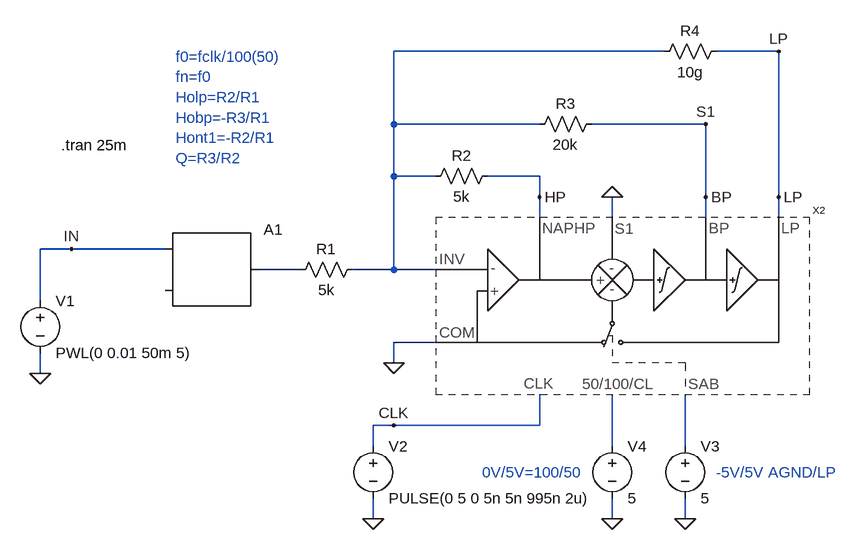
[diagram p0: schematic LTC1060_Mode1.asc]
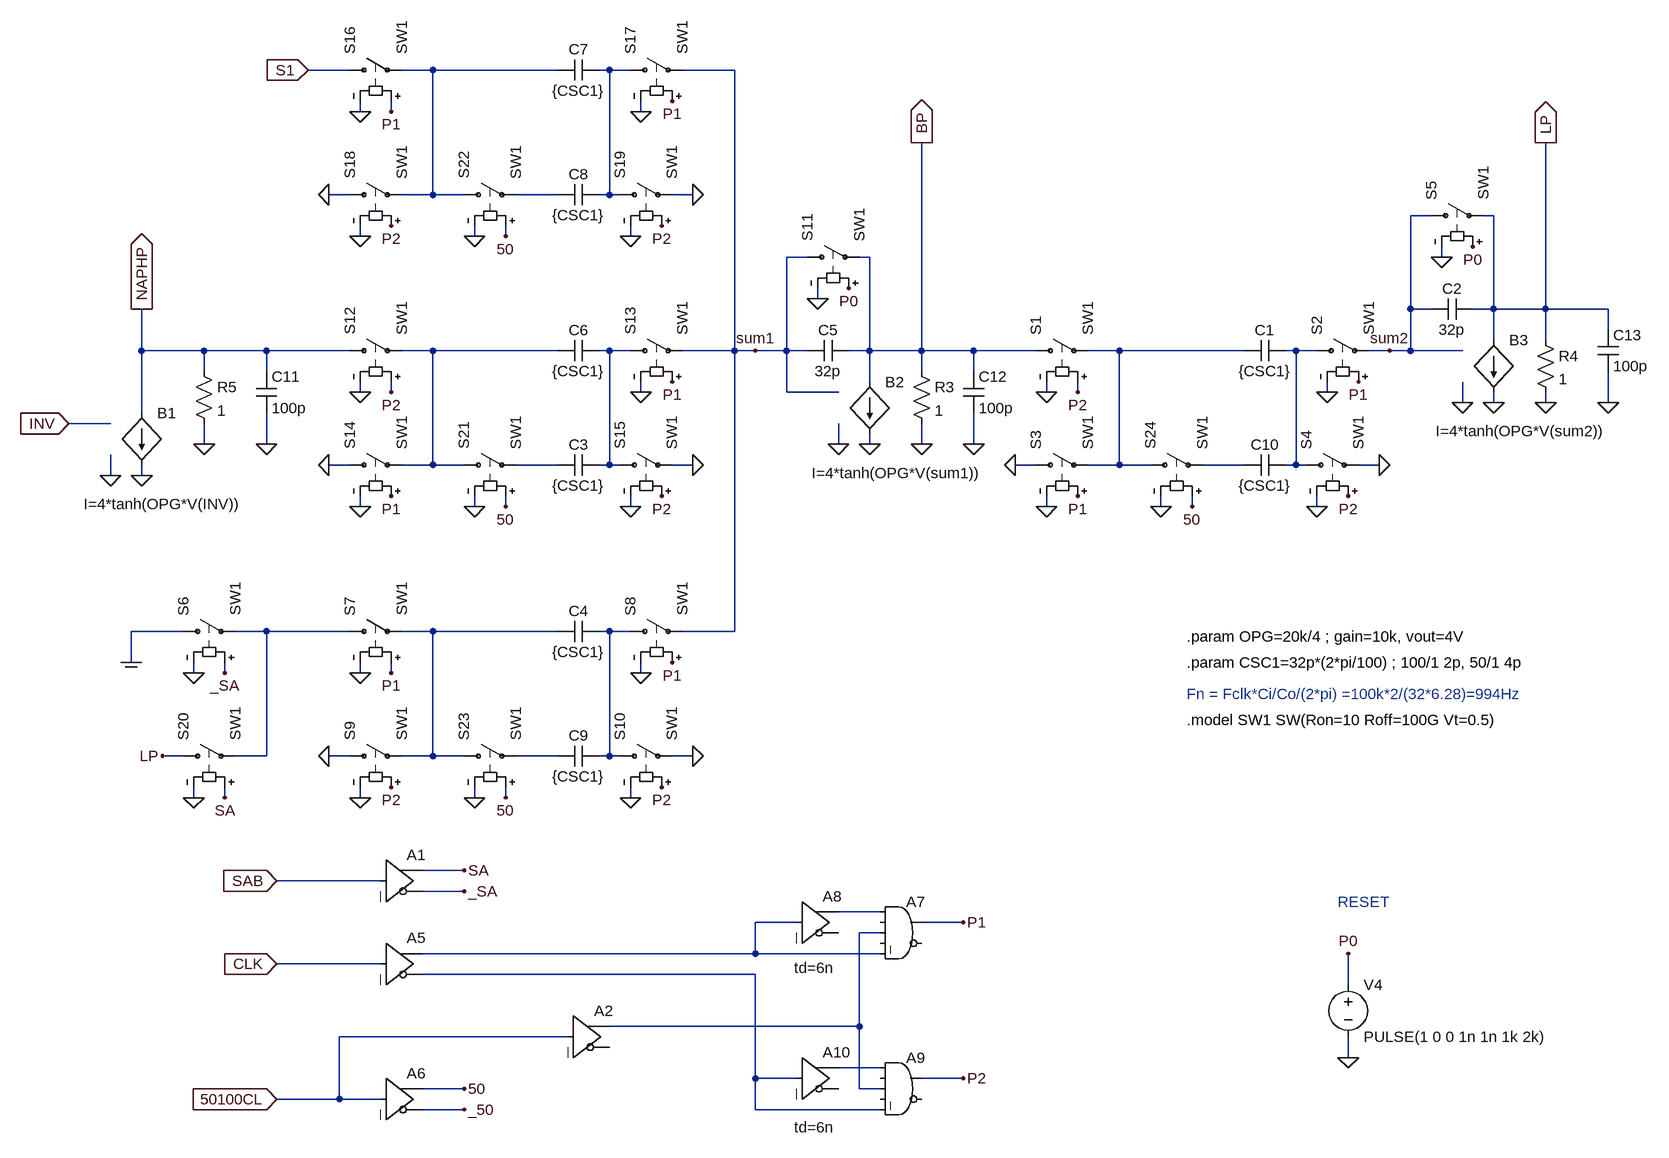
[diagram p1: sub-circuit ltc1060.asc]
LTC1060_Mode1.asc, the LTspice schematic file:
Version 4
SHEET 1 880 680
WIRE 320 -208 -96 -208
WIRE 496 -208 400 -208
WIRE -96 -96 -96 -208
WIRE 128 -96 -96 -96
WIRE 384 -96 208 -96
WIRE -96 -16 -96 -96
WIRE -32 -16 -96 -16
WIRE 128 -16 48 -16
WIRE 128 16 128 -16
WIRE 384 16 384 -96
WIRE 496 16 496 -208
WIRE 128 48 128 16
WIRE 240 48 240 16
WIRE 384 48 384 16
WIRE 496 48 496 16
WIRE -592 96 -640 96
WIRE -448 96 -592 96
WIRE -240 128 -304 128
WIRE -96 128 -96 -16
WIRE -96 128 -160 128
WIRE -32 128 -96 128
WIRE -640 176 -640 96
WIRE -32 240 -96 240
WIRE -96 272 -96 240
WIRE -640 288 -640 256
WIRE -96 368 -128 368
WIRE 128 368 128 320
WIRE 128 368 -96 368
WIRE -128 400 -128 368
WIRE 240 400 240 320
WIRE 352 400 352 320
WIRE -128 512 -128 480
WIRE 240 512 240 480
WIRE 352 512 352 480
FLAG -96 272 0
FLAG 352 512 0
FLAG 496 -208 LP
FLAG 384 -96 S1
FLAG 384 16 BP
FLAG -592 96 IN
FLAG -640 288 0
FLAG -96 368 CLK
FLAG -128 512 0
FLAG 240 512 0
FLAG 240 16 0
FLAG 496 16 LP
FLAG 128 16 HP
SYMBOL res 112 -80 R270
WINDOW 0 32 56 VTop 0
WINDOW 3 0 56 VBottom 0
SYMATTR InstName R3
SYMATTR Value 20k
SYMBOL res -48 0 R270
WINDOW 0 32 56 VTop 0
WINDOW 3 0 56 VBottom 0
SYMATTR InstName R2
SYMATTR Value 5k
SYMBOL res 304 -192 R270
WINDOW 0 32 56 VTop 0
WINDOW 3 0 56 VBottom 0
SYMATTR InstName R4
SYMATTR Value 10g
SYMBOL res -256 144 R270
WINDOW 0 32 56 VTop 0
WINDOW 3 0 56 VBottom 0
SYMATTR InstName R1
SYMATTR Value 5k
SYMBOL voltage -640 160 R0
WINDOW 123 0 0 Left 0
WINDOW 39 0 0 Left 0
SYMATTR InstName V1
SYMATTR Value PWL(0 0.01 50m 5)
SYMBOL voltage -128 384 R0
WINDOW 123 0 0 Left 0
WINDOW 39 0 0 Left 0
SYMATTR InstName V2
SYMATTR Value PULSE(0 5 0 5n 5n 995n 2u)
SYMBOL voltage 352 384 R0
WINDOW 123 0 0 Left 0
WINDOW 39 0 0 Left 0
SYMATTR InstName V3
SYMATTR Value 5
SYMBOL voltage 240 384 R0
WINDOW 123 0 0 Left 0
WINDOW 39 0 0 Left 0
SYMATTR InstName V4
SYMATTR Value 5
SYMBOL SpecialFunctions\\modulate -448 96 R0
SYMATTR InstName A1
SYMATTR Value2 space 0k mark 10k
SYMBOL LTC1060 128 192 R0
SYMATTR InstName X2
TEXT -608 -64 Left 0 !.tran 25m
TEXT 400 440 Left 0 ;-5V/5V AGND/LP
TEXT 40 440 Left 0 ;0V/5V=100/50
TEXT -432 -200 Left 0 ;f0=fclk/100(50)\nfn=f0\nHolp=R2/R1\nHobp=-R3/R1\nHont1=-R2/R1\nQ=R3/R2

ltc1060.asc, the sub-circuit schematic file:
Version 4
SHEET 1 1276 1464
WIRE -864 -256 -928 -256
WIRE -736 -256 -784 -256
WIRE -544 -256 -736 -256
WIRE -464 -256 -480 -256
WIRE -432 -256 -464 -256
WIRE -272 -256 -352 -256
WIRE -848 -192 -848 -208
WIRE -800 -192 -800 -208
WIRE -416 -192 -416 -208
WIRE -864 -64 -896 -64
WIRE -736 -64 -736 -256
WIRE -736 -64 -784 -64
WIRE -688 -64 -736 -64
WIRE -544 -64 -608 -64
WIRE -464 -64 -464 -256
WIRE -464 -64 -480 -64
WIRE -448 -64 -464 -64
WIRE -336 -64 -368 -64
WIRE 800 -32 768 -32
WIRE 896 -32 880 -32
WIRE -848 0 -848 -16
WIRE -672 0 -672 -16
WIRE -624 0 -624 -16
WIRE -432 0 -432 -16
WIRE -160 32 -192 32
WIRE -64 32 -80 32
WIRE 816 32 816 16
WIRE -144 96 -144 80
WIRE 768 112 768 -32
WIRE 800 112 768 112
WIRE 896 112 896 -32
WIRE 896 112 864 112
WIRE 976 112 976 -144
WIRE 976 112 896 112
WIRE 1072 112 976 112
WIRE 1072 144 1072 112
WIRE 896 160 896 112
WIRE 976 160 976 112
WIRE -1184 176 -1184 112
WIRE -1088 176 -1184 176
WIRE -992 176 -1088 176
WIRE -864 176 -992 176
WIRE -736 176 -784 176
WIRE -544 176 -736 176
WIRE -464 176 -480 176
WIRE -432 176 -464 176
WIRE -272 176 -272 -256
WIRE -272 176 -352 176
WIRE -240 176 -272 176
WIRE -192 176 -192 32
WIRE -192 176 -240 176
WIRE -160 176 -192 176
WIRE -64 176 -64 32
WIRE -64 176 -96 176
WIRE 16 176 16 -144
WIRE 16 176 -64 176
WIRE 96 176 16 176
WIRE 192 176 96 176
WIRE 320 176 272 176
WIRE 512 176 320 176
WIRE 592 176 576 176
WIRE 624 176 592 176
WIRE 736 176 704 176
WIRE 768 176 768 112
WIRE 768 176 736 176
WIRE 848 176 768 176
WIRE -1088 208 -1088 176
WIRE -992 208 -992 176
WIRE 16 208 16 176
WIRE 96 208 96 176
WIRE -64 224 -64 176
WIRE -848 240 -848 224
WIRE -800 240 -800 224
WIRE -416 240 -416 224
WIRE -192 240 -192 176
WIRE -112 240 -192 240
WIRE 208 240 208 224
WIRE 256 240 256 224
WIRE 640 240 640 224
WIRE 848 256 848 224
WIRE 896 256 896 240
WIRE 976 256 976 240
WIRE 1072 256 1072 208
WIRE -1184 272 -1184 176
WIRE -1232 288 -1296 288
WIRE -1088 320 -1088 288
WIRE -992 320 -992 272
WIRE -112 320 -112 288
WIRE -64 320 -64 304
WIRE 16 320 16 288
WIRE 96 320 96 272
WIRE -864 352 -896 352
WIRE -736 352 -736 176
WIRE -736 352 -784 352
WIRE -688 352 -736 352
WIRE -544 352 -608 352
WIRE -464 352 -464 176
WIRE -464 352 -480 352
WIRE -448 352 -464 352
WIRE -336 352 -368 352
WIRE 192 352 160 352
WIRE 320 352 320 176
WIRE 320 352 272 352
WIRE 368 352 320 352
WIRE 512 352 448 352
WIRE 592 352 592 176
WIRE 592 352 576 352
WIRE 608 352 592 352
WIRE 720 352 688 352
WIRE -1232 368 -1232 336
WIRE -1184 368 -1184 352
WIRE -848 416 -848 400
WIRE -672 416 -672 400
WIRE -624 416 -624 400
WIRE -432 416 -432 400
WIRE 208 416 208 400
WIRE 384 416 384 400
WIRE 432 416 432 400
WIRE 624 416 624 400
WIRE -1120 608 -1200 608
WIRE -992 608 -1040 608
WIRE -864 608 -992 608
WIRE -736 608 -784 608
WIRE -544 608 -736 608
WIRE -464 608 -480 608
WIRE -432 608 -464 608
WIRE -272 608 -272 176
WIRE -272 608 -352 608
WIRE -1200 656 -1200 608
WIRE -1104 672 -1104 656
WIRE -1056 672 -1056 656
WIRE -848 672 -848 656
WIRE -800 672 -800 656
WIRE -416 672 -416 656
WIRE -1120 800 -1152 800
WIRE -992 800 -992 608
WIRE -992 800 -1040 800
WIRE -864 800 -896 800
WIRE -736 800 -736 608
WIRE -736 800 -784 800
WIRE -688 800 -736 800
WIRE -544 800 -608 800
WIRE -464 800 -464 608
WIRE -464 800 -480 800
WIRE -448 800 -464 800
WIRE -336 800 -368 800
WIRE -1104 864 -1104 848
WIRE -1056 864 -1056 848
WIRE -848 864 -848 848
WIRE -672 864 -672 848
WIRE -624 864 -624 848
WIRE -432 864 -432 848
WIRE -688 976 -752 976
WIRE -816 992 -976 992
WIRE -688 1008 -752 1008
WIRE -48 1040 -112 1040
WIRE -176 1056 -240 1056
WIRE 80 1056 16 1056
WIRE -48 1072 -80 1072
WIRE -240 1104 -240 1056
WIRE -240 1104 -752 1104
WIRE -48 1104 -240 1104
WIRE -816 1120 -976 1120
WIRE -240 1136 -752 1136
WIRE 672 1152 672 1104
WIRE -80 1216 -80 1072
WIRE -80 1216 -464 1216
WIRE -528 1232 -880 1232
WIRE 672 1264 672 1232
WIRE -48 1280 -112 1280
WIRE -240 1296 -240 1136
WIRE -176 1296 -240 1296
WIRE 80 1296 16 1296
WIRE -688 1312 -752 1312
WIRE -80 1312 -80 1216
WIRE -48 1312 -80 1312
WIRE -880 1328 -880 1232
WIRE -880 1328 -976 1328
WIRE -816 1328 -880 1328
WIRE -688 1344 -752 1344
WIRE -240 1344 -240 1296
WIRE -48 1344 -240 1344
FLAG 848 256 0
FLAG 896 256 0
FLAG 720 352 0
FLAG 160 352 0
FLAG 208 240 0
FLAG 640 240 0
FLAG 208 416 0
FLAG 624 416 0
FLAG 256 240 P2
FLAG 688 224 P1
FLAG 672 400 P2
FLAG 256 400 P1
FLAG 816 32 0
FLAG 864 16 P0
FLAG 672 1264 0
FLAG 672 1104 P0
FLAG 976 -144 LP
IOPIN 976 -144 Out
FLAG -112 320 0
FLAG -64 320 0
FLAG -336 800 0
FLAG -896 800 0
FLAG -848 672 0
FLAG -416 672 0
FLAG -848 864 0
FLAG -432 864 0
FLAG -800 672 P1
FLAG -368 656 P1
FLAG -384 848 P2
FLAG -800 848 P2
FLAG -144 96 0
FLAG -96 80 P0
FLAG 16 -144 BP
IOPIN 16 -144 Out
FLAG -336 352 0
FLAG -896 352 0
FLAG -848 240 0
FLAG -416 240 0
FLAG -848 416 0
FLAG -432 416 0
FLAG -800 240 P2
FLAG -368 224 P1
FLAG -384 400 P2
FLAG -800 400 P1
FLAG -1232 368 0
FLAG -1184 368 0
FLAG -336 -64 0
FLAG -896 -64 0
FLAG -848 -192 0
FLAG -416 -192 0
FLAG -848 0 0
FLAG -432 0 0
FLAG -800 -192 P1
FLAG -368 -208 P1
FLAG -384 -16 P2
FLAG -800 -16 P2
FLAG -928 -256 S1
IOPIN -928 -256 In
FLAG -1296 288 INV
IOPIN -1296 288 In
FLAG 16 320 0
FLAG 976 256 0
FLAG -1088 320 0
FLAG -1184 112 NAPHP
IOPIN -1184 112 Out
FLAG -1104 672 0
FLAG -1056 672 _SA
FLAG -1104 864 0
FLAG -1056 864 SA
FLAG -1152 800 LP
FLAG -976 992 SAB
IOPIN -976 992 In
FLAG -688 976 SA
FLAG -688 1008 _SA
FLAG -976 1120 CLK
IOPIN -976 1120 In
FLAG -976 1328 50100CL
IOPIN -976 1328 In
FLAG -672 416 0
FLAG -624 416 50
FLAG -672 0 0
FLAG -624 0 50
FLAG -672 864 0
FLAG -624 864 50
FLAG 384 416 0
FLAG 432 416 50
FLAG -688 1312 50
FLAG 80 1056 P1
FLAG 80 1296 P2
FLAG -1200 656 COM
FLAG -688 1344 _50
FLAG -240 176 sum1
FLAG 736 176 sum2
FLAG -992 320 0
FLAG 96 320 0
FLAG 1072 256 0
SYMBOL sw 176 176 R270
SYMATTR InstName S1
SYMATTR Value SW1
SYMBOL sw 608 176 R270
SYMATTR InstName S2
SYMATTR Value SW1
SYMBOL cap 512 192 R270
WINDOW 0 32 32 VTop 0
WINDOW 3 0 32 VBottom 0
SYMATTR InstName C1
SYMATTR Value {CSC1}
SYMBOL cap 800 128 R270
WINDOW 0 32 32 VTop 0
WINDOW 3 0 32 VBottom 0
SYMATTR InstName C2
SYMATTR Value 32p
SYMBOL sw 176 352 R270
SYMATTR InstName S3
SYMATTR Value SW1
SYMBOL sw 592 352 R270
SYMATTR InstName S4
SYMATTR Value SW1
SYMBOL sw 784 -32 R270
SYMATTR InstName S5
SYMATTR Value SW1
SYMBOL voltage 672 1136 R0
WINDOW 123 0 0 Left 0
WINDOW 39 0 0 Left 0
SYMATTR InstName V4
SYMATTR Value PULSE(1 0 0 1n 1n 1k 2k)
SYMBOL sw -880 608 R270
SYMATTR InstName S7
SYMATTR Value SW1
SYMBOL sw -448 608 R270
SYMATTR InstName S8
SYMATTR Value SW1
SYMBOL cap -544 624 R270
WINDOW 0 32 32 VTop 0
WINDOW 3 0 32 VBottom 0
SYMATTR InstName C4
SYMATTR Value {CSC1}
SYMBOL cap -160 192 R270
WINDOW 0 32 32 VTop 0
WINDOW 3 0 32 VBottom 0
SYMATTR InstName C5
SYMATTR Value 32p
SYMBOL sw -880 800 R270
SYMATTR InstName S9
SYMATTR Value SW1
SYMBOL sw -464 800 R270
SYMATTR InstName S10
SYMATTR Value SW1
SYMBOL sw -176 32 R270
SYMATTR InstName S11
SYMATTR Value SW1
SYMBOL sw -880 176 R270
SYMATTR InstName S12
SYMATTR Value SW1
SYMBOL sw -448 176 R270
SYMATTR InstName S13
SYMATTR Value SW1
SYMBOL cap -544 192 R270
WINDOW 0 32 32 VTop 0
WINDOW 3 0 32 VBottom 0
SYMATTR InstName C6
SYMATTR Value {CSC1}
SYMBOL sw -880 352 R270
SYMATTR InstName S14
SYMATTR Value SW1
SYMBOL sw -464 352 R270
SYMATTR InstName S15
SYMATTR Value SW1
SYMBOL sw -880 -256 R270
SYMATTR InstName S16
SYMATTR Value SW1
SYMBOL sw -448 -256 R270
SYMATTR InstName S17
SYMATTR Value SW1
SYMBOL cap -544 -240 R270
WINDOW 0 32 32 VTop 0
WINDOW 3 0 32 VBottom 0
SYMATTR InstName C7
SYMATTR Value {CSC1}
SYMBOL sw -880 -64 R270
SYMATTR InstName S18
SYMATTR Value SW1
SYMBOL sw -464 -64 R270
SYMATTR InstName S19
SYMATTR Value SW1
SYMBOL res 0 192 R0
SYMATTR InstName R3
SYMATTR Value 1
SYMBOL res 960 144 R0
SYMATTR InstName R4
SYMATTR Value 1
SYMBOL res -1104 192 R0
SYMATTR InstName R5
SYMATTR Value 1
SYMBOL sw -1136 608 R270
SYMATTR InstName S6
SYMATTR Value SW1
SYMBOL sw -1136 800 R270
SYMATTR InstName S20
SYMATTR Value SW1
SYMBOL Digital\\buf -816 928 R0
SYMATTR InstName A1
SYMATTR Value2 REF=1
SYMATTR SpiceLine VHIGH=1 VLOW=0
SYMBOL Digital\\buf -816 1056 R0
SYMATTR InstName A5
SYMATTR Value2 REF=1
SYMATTR SpiceLine VHIGH=1 VLOW=0
SYMBOL Digital\\buf -816 1264 R0
SYMATTR InstName A6
SYMATTR Value2 REF=1
SYMATTR SpiceLine VHIGH=1 VLOW=0
SYMBOL sw -704 352 R270
SYMATTR InstName S21
SYMATTR Value SW1
SYMBOL cap -544 368 R270
WINDOW 0 32 32 VTop 0
WINDOW 3 0 32 VBottom 0
SYMATTR InstName C3
SYMATTR Value {CSC1}
SYMBOL sw -704 -64 R270
SYMATTR InstName S22
SYMATTR Value SW1
SYMBOL cap -544 -48 R270
WINDOW 0 32 32 VTop 0
WINDOW 3 0 32 VBottom 0
SYMATTR InstName C8
SYMATTR Value {CSC1}
SYMBOL sw -704 800 R270
SYMATTR InstName S23
SYMATTR Value SW1
SYMBOL cap -544 816 R270
WINDOW 0 32 32 VTop 0
WINDOW 3 0 32 VBottom 0
SYMATTR InstName C9
SYMATTR Value {CSC1}
SYMBOL sw 352 352 R270
SYMATTR InstName S24
SYMATTR Value SW1
SYMBOL cap 512 368 R270
WINDOW 0 32 32 VTop 0
WINDOW 3 0 32 VBottom 0
SYMATTR InstName C10
SYMATTR Value {CSC1}
SYMBOL Digital\\and -16 1008 R0
SYMATTR InstName A7
SYMATTR SpiceLine trise=2n
SYMBOL Digital\\buf -176 992 R0
WINDOW 39 -4 134 Left 0
SYMATTR SpiceLine td=6n
SYMATTR InstName A8
SYMBOL Digital\\and -16 1248 R0
SYMATTR InstName A9
SYMATTR SpiceLine trise=5n
SYMBOL Digital\\buf -176 1232 R0
WINDOW 39 -4 139 Left 0
SYMATTR SpiceLine td=6n
SYMATTR InstName A10
SYMBOL Digital\\buf -528 1168 R0
SYMATTR InstName A2
SYMATTR Value2 REF=-1
SYMATTR SpiceLine VHIGH=1 VLOW=0
SYMBOL bi -1184 272 R0
WINDOW 3 -89 140 Left 0
SYMATTR Value I=4*tanh(OPG*V(INV))
SYMATTR InstName B1
SYMBOL bi -64 224 R0
WINDOW 3 -89 140 Left 0
SYMATTR Value I=4*tanh(OPG*V(sum1))
SYMATTR InstName B2
SYMBOL bi 896 160 R0
WINDOW 3 -89 140 Left 0
SYMATTR Value I=4*tanh(OPG*V(sum2))
SYMATTR InstName B3
SYMBOL cap -1008 208 R0
SYMATTR InstName C11
SYMATTR Value 100p
SYMBOL cap 80 208 R0
SYMATTR InstName C12
SYMATTR Value 100p
SYMBOL cap 1056 144 R0
SYMATTR InstName C13
SYMATTR Value 100p
TEXT 424 744 Left 0 !.model SW1 SW(Ron=10 Roff=100G Vt=0.5)
TEXT 424 656 Left 0 !.param CSC1=32p*(2*pi/100) ; 100/1 2p, 50/1 4p
TEXT 424 704 Left 0 ;Fn = Fclk*Ci/Co/(2*pi) =100k*2/(32*6.28)=994Hz
TEXT 656 1024 Left 0 ;RESET
TEXT 424 616 Left 0 !.param OPG=20k/4 ; gain=10k, vout=4V

The netlist it stands for:
* LTC1060_Mode1.asc
R3 N001 BP 20k
R2 N001 HP 5k
R4 N001 LP 10g
R1 N002 N001 5k
V1 IN 0 PWL(0 0.01 50m 5)
V2 CLK 0 PULSE(0 5 0 5n 5n 995n 2u)
V3 N004 0 5
V4 N003 0 5
A1 IN 0 0 0 0 0 N002 0 MODULATOR space 0k mark 10k
XX2 N001 HP 0 BP LP CLK N003 N004 0 ltc1060

* block symbol definitions
.subckt ltc1060 INV NAPHP S1 BP LP CLK 50100CL SAB COM
S1 BP N006 P2 0 SW1
S2 N007 sum2 P1 0 SW1
C1 N006 N007 {CSC1}
C2 sum2 LP 32p
S3 0 N006 P1 0 SW1
S4 N007 0 P2 0 SW1
S5 sum2 LP P0 0 SW1
V4 P0 0 PULSE(1 0 0 1n 1n 1k 2k)
S7 N010 N011 P1 0 SW1
S8 N012 sum1 P1 0 SW1
C4 N011 N012 {CSC1}
C5 sum1 BP 32p
S9 0 N011 P2 0 SW1
S10 N012 0 P2 0 SW1
S11 sum1 BP P0 0 SW1
S12 NAPHP N004 P2 0 SW1
S13 N005 sum1 P1 0 SW1
C6 N004 N005 {CSC1}
S14 0 N004 P1 0 SW1
S15 N005 0 P2 0 SW1
S16 S1 N001 P1 0 SW1
S17 N002 sum1 P1 0 SW1
C7 N001 N002 {CSC1}
S18 0 N001 P2 0 SW1
S19 N002 0 P2 0 SW1
R3 BP 0 1
R4 LP 0 1
R5 NAPHP 0 1
S6 COM N010 _SA 0 SW1
S20 LP N010 SA 0 SW1
A1 SAB 0 0 0 0 _SA SA 0 BUF REF=1 VHIGH=1 VLOW=0
A5 CLK 0 0 0 0 N017 N015 0 BUF REF=1 VHIGH=1 VLOW=0
A6 50100CL 0 0 0 0 _50 50 0 BUF REF=1 VHIGH=1 VLOW=0
S21 N004 N008 50 0 SW1
C3 N008 N005 {CSC1}
S22 N001 N003 50 0 SW1
C8 N003 N002 {CSC1}
S23 N011 N013 50 0 SW1
C9 N013 N012 {CSC1}
S24 N006 N009 50 0 SW1
C10 N009 N007 {CSC1}
A7 N014 0 N016 0 N015 0 P1 0 AND trise=2n
A8 N015 0 0 0 0 0 N014 0 BUF td=6n
A9 N018 0 N016 0 N017 0 P2 0 AND trise=5n
A10 N017 0 0 0 0 0 N018 0 BUF td=6n
A2 50100CL 0 0 0 0 0 N016 0 BUF REF=-1 VHIGH=1 VLOW=0
B1 NAPHP 0 I=4*tanh(OPG*V(INV))
B2 BP 0 I=4*tanh(OPG*V(sum1))
B3 LP 0 I=4*tanh(OPG*V(sum2))
C11 NAPHP 0 100p
C12 BP 0 100p
C13 LP 0 100p
.model SW1 SW(Ron=10 Roff=100G Vt=0.5)
.param CSC1=32p*(2*pi/100) ; 100/1 2p, 50/1 4p
* Fn = Fclk*Ci/Co/(2*pi) =100k*2/(32*6.28)=994Hz
* RESET
.param OPG=20k/4 ; gain=10k, vout=4V
.ends ltc1060

.tran 25m
* -5V/5V AGND/LP
* 0V/5V=100/50
* f0=fclk/100(50)
* fn=f0
* Holp=R2/R1
* Hobp=-R3/R1
* Hont1=-R2/R1
* Q=R3/R2
.backanno
.end